# EAGLE schematic s16_panel_1 (EAGLE 7.3.0)

## Sheet 1 of 2
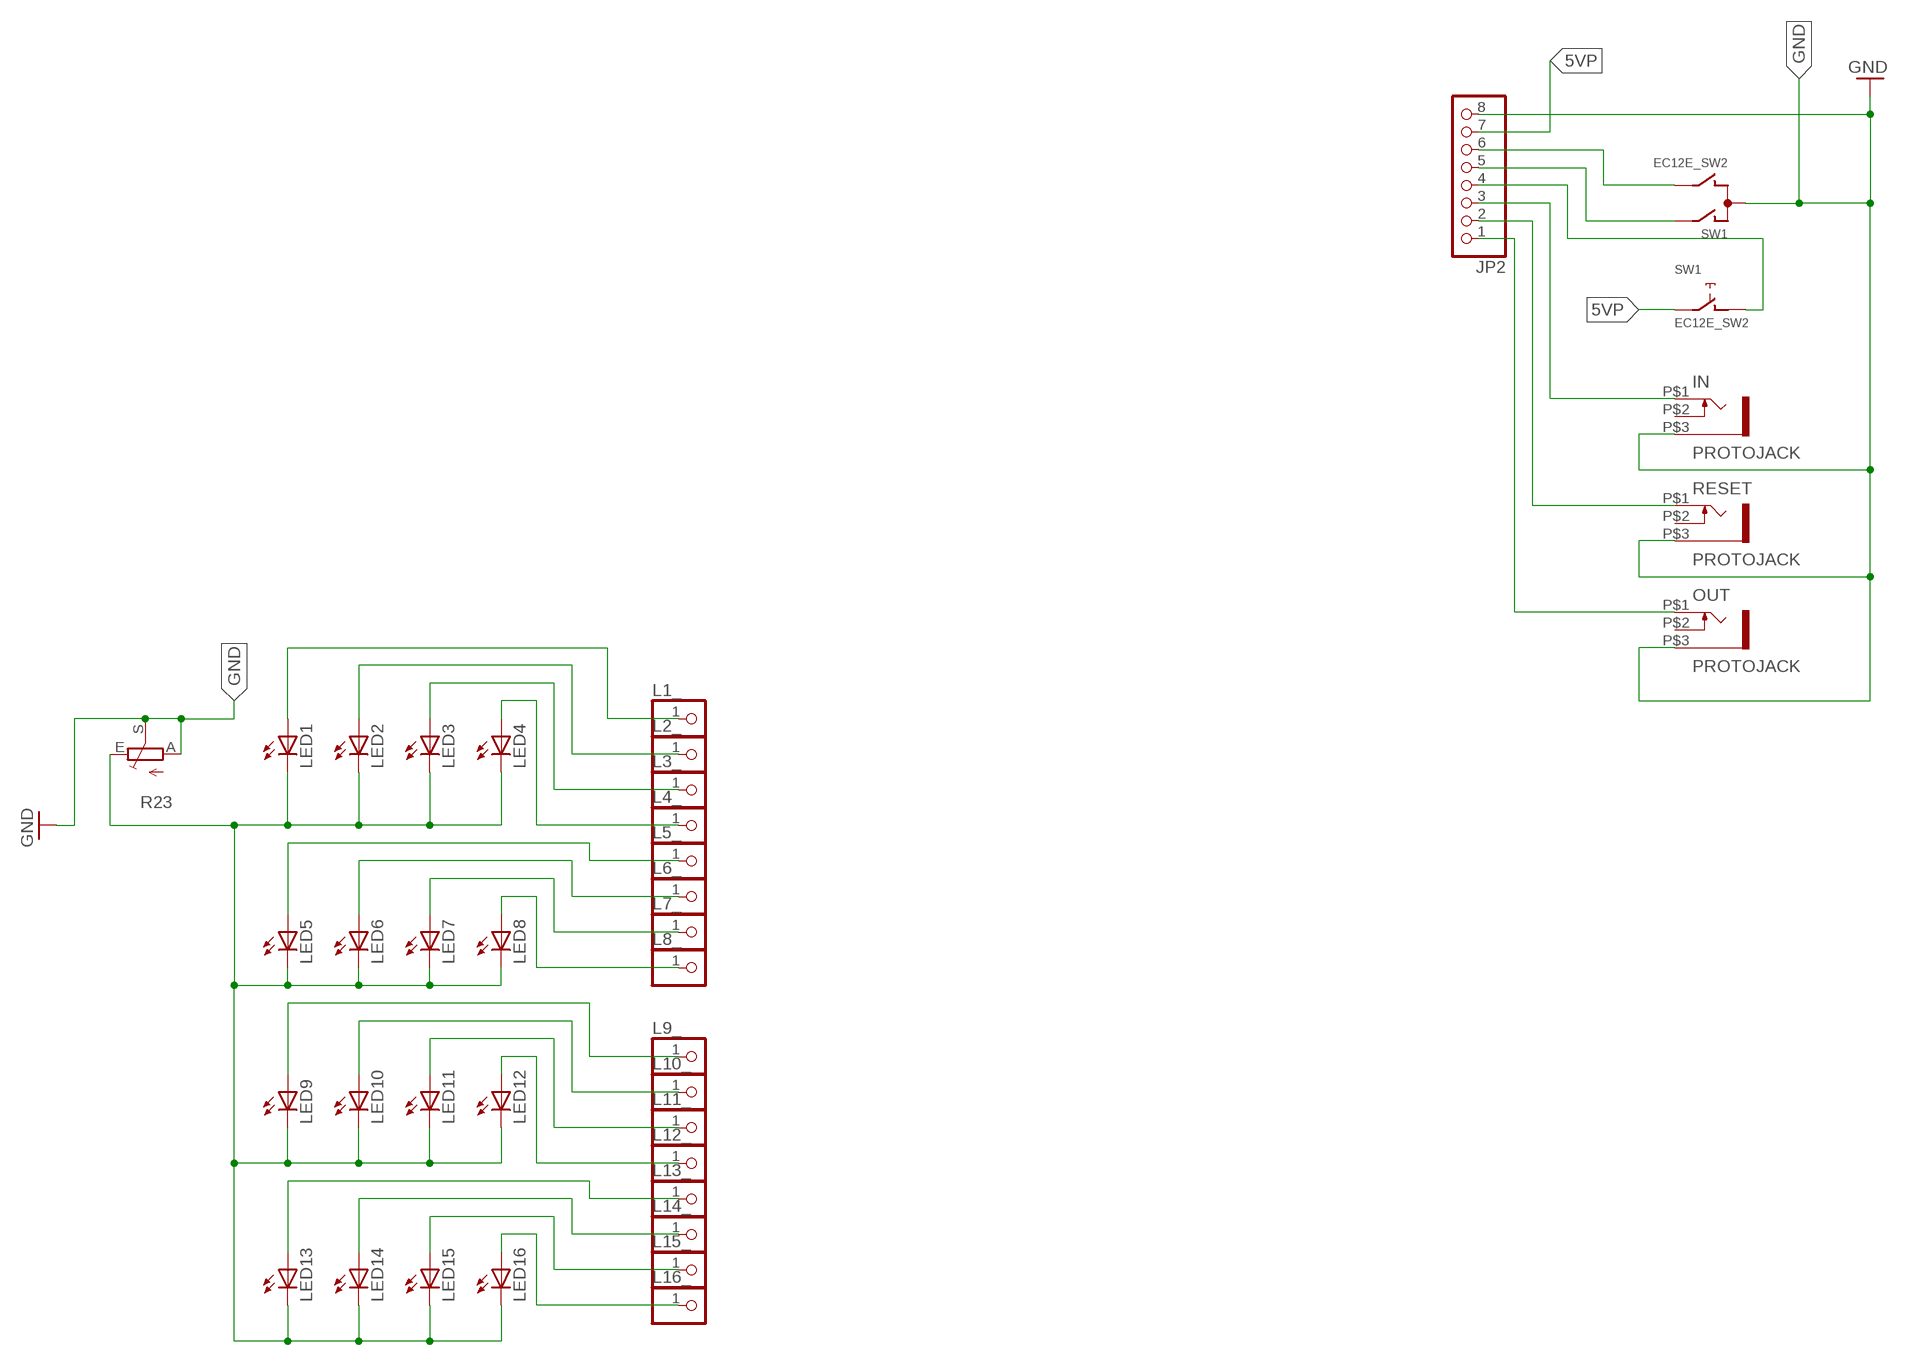
[diagram p0: schematic, sheet 1]

### Parts
IN  PROTOJACK  [PROTOJACK]
JP2  PINHD-1X8BIG  [1X08-BIG]
L1_  PINHD-1X1  [1X01]
L2_  PINHD-1X1  [1X01]
L3_  PINHD-1X1  [1X01]
L4_  PINHD-1X1  [1X01]
L5_  PINHD-1X1  [1X01]
L6_  PINHD-1X1  [1X01]
L7_  PINHD-1X1  [1X01]
L8_  PINHD-1X1  [1X01]
L9_  PINHD-1X1  [1X01]
L10_  PINHD-1X1  [1X01]
L11_  PINHD-1X1  [1X01]
L12_  PINHD-1X1  [1X01]
L13_  PINHD-1X1  [1X01]
L14_  PINHD-1X1  [1X01]
L15_  PINHD-1X1  [1X01]
L16_  PINHD-1X1  [1X01]
LED1  LED3MM  [LED3MM]
LED2  LED3MM  [LED3MM]
LED3  LED3MM  [LED3MM]
LED4  LED3MM  [LED3MM]
LED5  LED3MM  [LED3MM]
LED6  LED3MM  [LED3MM]
LED7  LED3MM  [LED3MM]
LED8  LED3MM  [LED3MM]
LED9  LED3MM  [LED3MM]
LED10  LED3MM  [LED3MM]
LED11  LED3MM  [LED3MM]
LED12  LED3MM  [LED3MM]
LED13  LED3MM  [LED3MM]
LED14  LED3MM  [LED3MM]
LED15  LED3MM  [LED3MM]
LED16  LED3MM  [LED3MM]
OUT  PROTOJACK  [PROTOJACK]
R23  TRIM_EU-RJ9W  [RJ9W]
RESET  PROTOJACK  [PROTOJACK]
SW1  EC12E_SW2  [ALPS_EC12E_SW_NOSUPPORT]

### Nets
5VP: JP2.7 SW1.E
GND: IN.P$3 JP2.8 OUT.P$3 R23.A R23.S RESET.P$3 SW1.C
N$7: JP2.6 SW1.B
N$10: IN.P$1 JP2.3
N$46: L1_.1 LED1.A
N$47: L4_.1 LED4.A
N$48: L3_.1 LED3.A
N$49: L2_.1 LED2.A
N$50: JP2.2 RESET.P$1
N$51: L8_.1 LED8.A
N$52: L7_.1 LED7.A
N$53: L6_.1 LED6.A
N$54: L5_.1 LED5.A
N$56: L12_.1 LED12.A
N$57: L11_.1 LED11.A
N$58: L10_.1 LED10.A
N$59: L9_.1 LED9.A
N$60: JP2.5 SW1.A
N$61: L16_.1 LED16.A
N$62: L15_.1 LED15.A
N$63: L14_.1 LED14.A
N$64: L13_.1 LED13.A
N$65: JP2.4 SW1.D
N$66: JP2.1 OUT.P$1
N$67: LED1.K(C) LED2.K(C) LED3.K(C) LED4.K(C) LED5.K(C) LED6.K(C) LED7.K(C) LED8.K(C) LED9.K(C) LED10.K(C) LED11.K(C) LED12.K(C) LED13.K(C) LED14.K(C) LED15.K(C) LED16.K(C) R23.E
Unconnected: IN.P$2 OUT.P$2 RESET.P$2 SW1.GND2(G)

## Sheet 2 of 2

## Library data of the parts
IN OUT RESET = thonkiconn:PROTOJACK
JP2 = adafruit:PINHD-1X8: PIN HEADER
L1_ L2_ L3_ L4_ L5_ L6_ L7_ L8_ L9_ L10_ L11_ L12_ L13_ L14_ L15_ L16_ = adafruit:PINHD-1X1: Pin header 1x1 for 0.1" spacing With round pins
LED1-LED16 = adafruit:LED: LED OSRAM: - CHIPLED LG R971, LG N971, LY N971, LG Q971, LY Q971, LO R971, LY R971 LH N974, LH R974 LS Q976, LO Q976, LY Q976 LO Q996 - Hyper CHIPLED LW Q18S LB Q993, LB Q99A, LB R99A - SideLED LS A670, LO A670, LY A670, LG A670, LP A670 LB A673, LV A673, LT A673, LW A673 LH A674 LY A675 LS A676, LA A676, LO A676, LY A676, LW A676 LS A679, LY A679, LG A679 - Hyper Micro SIDELED® LS Y876, LA Y876, LO Y876, LY Y876 LT Y87S - SmartLED LW L88C, LW L88S LB L89C, LB L89S, LG L890 LS L89K, LO L89K, LY L89K LS L896, LA L896, LO L896, LY L896 - TOPLED LS T670, LO T670, LY T670, LG T670, LP T670 LSG T670, LSP T670, LSY T670, LOP T670, LYG T670 LG T671, LOG T671, LSG T671 LB T673, LV T673, LT T673, LW T673 LH T674 LS T676, LA T676, LO T676, LY T676, LB T676, LH T676, LSB T676, LW T676 LB T67C, LV T67C, LT T67C, LS T67K, LO T67K, LY T67K, LW E67C LS E67B, LA E67B, LO E67B, LY E67B, LB E67C, LV E67C, LT E67C LW T67C LS T679, LY T679, LG T679 LS T770, LO T770, LY T770, LG T770, LP T770 LB T773, LV T773, LT T773, LW T773 LH T774 LS E675, LA E675, LY E675, LS T675 LS T776, LA T776, LO T776, LY T776, LB T776 LHGB T686 LT T68C, LB T68C - Hyper Mini TOPLED® LB M676 - Mini TOPLED Santana® LG M470 LS M47K, LO M47K, LY M47K Source: http://www.osram.convergy.de/
R23 = pot:TRIM_EU-: POTENTIOMETER
SW1 = switch-alps:EC12E_SW2: ALPS rotary Encoder EC12E series with switch